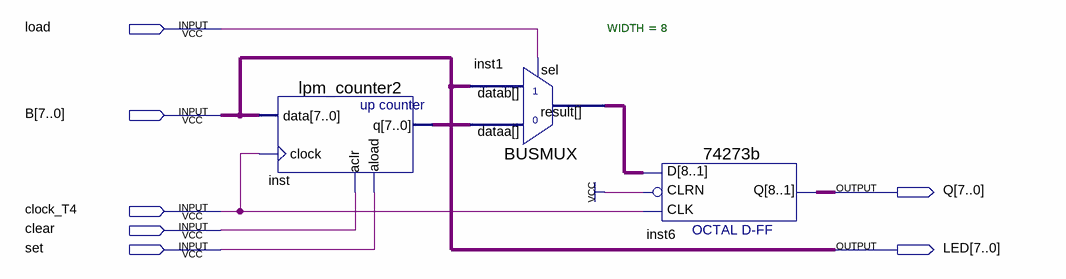
[diagram p0: schematic sheet]
// Quartus schematic Chapter4.bdf as structural Verilog: 3 symbols, 7 pins
module Chapter4 (
  input  load,
  input  [7:0] B,
  input  clock_T4,
  input  clear,
  input  set,
  output [7:0] Q,
  output [7:0] LED
);

  wire [7:0] inst1_result, inst_q;

  lpm_counter2 inst (.data(B), .clock(clock_T4), .aclr(clear), .aload(set), .q(inst_q));
  BUSMUX #(.WIDTH(8)) inst1 (.datab(B), .sel(load), .dataa(inst_q), .result(inst1_result));
  \74273b  inst6 (.CLK(clock_T4), .D(inst1_result), .CLRN(1'b1), .Q(Q));

  assign LED = B;
endmodule
